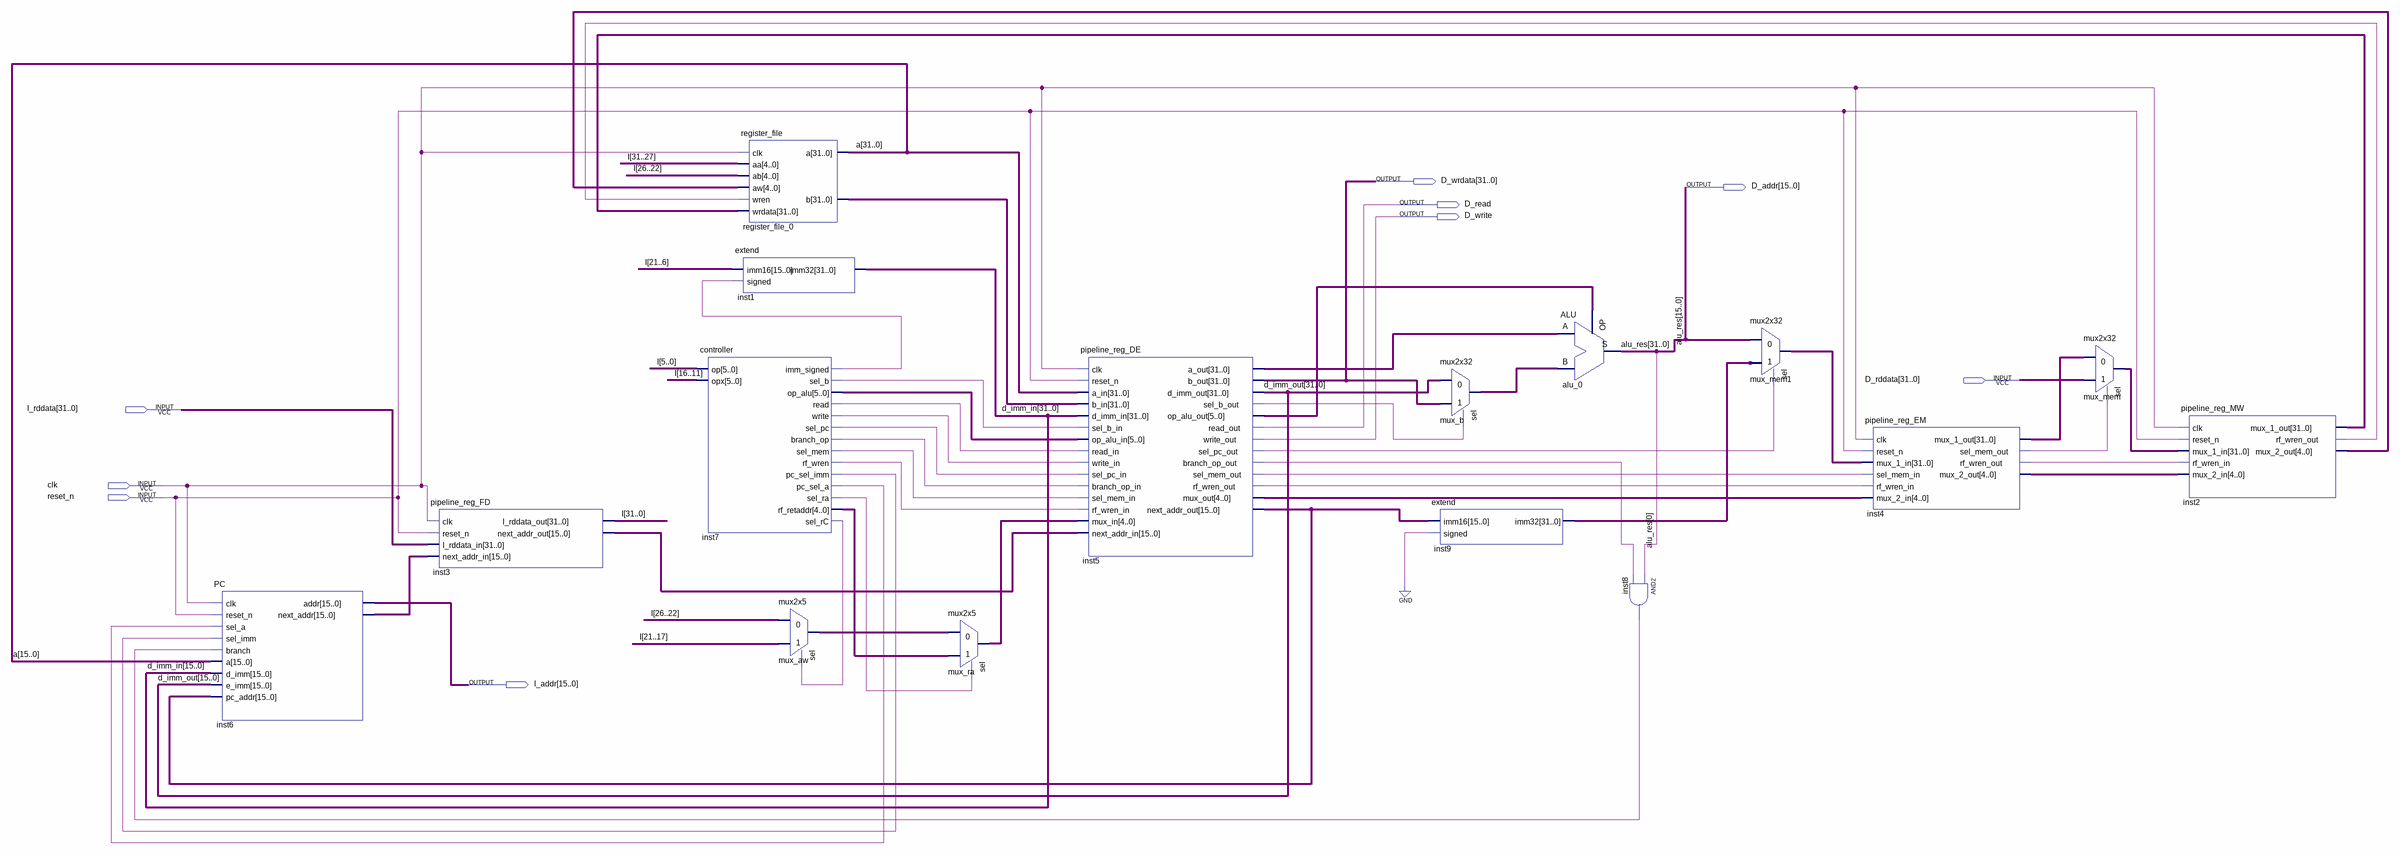
[diagram p0: schematic sheet]
// Quartus schematic CPU.bdf as structural Verilog: 16 symbols, 9 pins
module CPU (
  input  [31:0] D_rddata,
  input  [31:0] I_rddata,
  input  clk,
  input  reset_n,
  output [31:0] D_wrdata,
  output [15:0] D_addr,
  output D_read,
  output D_write,
  output [15:0] I_addr
);

  wire inst2_rf_wren_out, inst4_rf_wren_out, inst4_sel_mem_out, inst5_branch_op_out, inst5_rf_wren_out,
       inst5_sel_b_out, inst5_sel_mem_out, inst5_sel_pc_out, inst7_branch_op, inst7_imm_signed,
       inst7_pc_sel_a, inst7_pc_sel_imm, inst7_read, inst7_rf_wren, inst7_sel_b, inst7_sel_mem, inst7_sel_pc,
       inst7_sel_ra, inst7_sel_rc, inst7_write, inst8_out;
  wire [4:0] inst2_mux_2_out, inst4_mux_2_out, inst5_mux_out, inst7_rf_retaddr, mux_aw_o, mux_ra_o;
  wire [5:0] inst5_op_alu_out, inst7_op_alu;
  wire [15:0] inst3_next_addr_out, inst5_next_addr_out, inst6_next_addr;
  wire [31:0] a, d_imm_in, d_imm_out, I, inst2_mux_1_out, inst4_mux_1_out, inst5_a_out, inst9_imm32, mux_b_o,
       mux_mem1_o, mux_mem_o, register_file_0_b;
  wire [31:16] alu_res;

  PC inst6 (
    .clk(clk), .reset_n(reset_n), .sel_a(inst7_pc_sel_a), .sel_imm(inst7_pc_sel_imm), .branch(inst8_out),
    .a(a[15:0]), .d_imm(d_imm_in[15:0]), .e_imm(d_imm_out[15:0]), .pc_addr(inst5_next_addr_out),
    .addr(I_addr), .next_addr(inst6_next_addr));
  pipeline_reg_FD inst3 (
    .clk(clk), .reset_n(reset_n), .I_rddata_in(I_rddata), .next_addr_in(inst6_next_addr), .I_rddata_out(I),
    .next_addr_out(inst3_next_addr_out));
  register_file register_file_0 (
    .clk(clk), .aa(I[31:27]), .ab(I[26:22]), .aw(inst2_mux_2_out), .wren(inst2_rf_wren_out),
    .wrdata(inst2_mux_1_out), .a(a), .b(register_file_0_b));
  extend inst1 (.imm16(I[21:6]), .\signed (inst7_imm_signed), .imm32(d_imm_in));
  controller inst7 (
    .op(I[5:0]), .opx(I[16:11]), .imm_signed(inst7_imm_signed), .sel_b(inst7_sel_b), .op_alu(inst7_op_alu),
    .read(inst7_read), .write(inst7_write), .sel_pc(inst7_sel_pc), .branch_op(inst7_branch_op),
    .sel_mem(inst7_sel_mem), .rf_wren(inst7_rf_wren), .pc_sel_imm(inst7_pc_sel_imm),
    .pc_sel_a(inst7_pc_sel_a), .sel_ra(inst7_sel_ra), .rf_retaddr(inst7_rf_retaddr), .sel_rC(inst7_sel_rc));
  mux2x5 mux_aw (.i0(I[26:22]), .i1(I[21:17]), .sel(inst7_sel_rc), .o(mux_aw_o));
  mux2x5 mux_ra (.i0(mux_aw_o), .i1(inst7_rf_retaddr), .sel(inst7_sel_ra), .o(mux_ra_o));
  pipeline_reg_DE inst5 (
    .clk(clk), .reset_n(reset_n), .a_in(a), .b_in(register_file_0_b), .d_imm_in(d_imm_in),
    .sel_b_in(inst7_sel_b), .op_alu_in(inst7_op_alu), .read_in(inst7_read), .write_in(inst7_write),
    .sel_pc_in(inst7_sel_pc), .branch_op_in(inst7_branch_op), .sel_mem_in(inst7_sel_mem),
    .rf_wren_in(inst7_rf_wren), .mux_in(mux_ra_o), .next_addr_in(inst3_next_addr_out), .a_out(inst5_a_out),
    .b_out(D_wrdata), .d_imm_out(d_imm_out), .sel_b_out(inst5_sel_b_out), .op_alu_out(inst5_op_alu_out),
    .read_out(D_read), .write_out(D_write), .sel_pc_out(inst5_sel_pc_out),
    .branch_op_out(inst5_branch_op_out), .sel_mem_out(inst5_sel_mem_out), .rf_wren_out(inst5_rf_wren_out),
    .mux_out(inst5_mux_out), .next_addr_out(inst5_next_addr_out));
  mux2x32 mux_b (.i0(d_imm_out), .i1(D_wrdata), .sel(inst5_sel_b_out), .o(mux_b_o));
  extend inst9 (.imm16(inst5_next_addr_out), .\signed (1'b0), .imm32(inst9_imm32));
  ALU alu_0 (.a(inst5_a_out), .b(mux_b_o), .op(inst5_op_alu_out), .s({alu_res, D_addr}));
  and inst8 (inst8_out, D_addr[0], inst5_branch_op_out);
  mux2x32 mux_mem1 (.i0({alu_res, D_addr}), .i1(inst9_imm32), .sel(inst5_sel_pc_out), .o(mux_mem1_o));
  pipeline_reg_EM inst4 (
    .clk(clk), .reset_n(reset_n), .mux_1_in(mux_mem1_o), .sel_mem_in(inst5_sel_mem_out),
    .rf_wren_in(inst5_rf_wren_out), .mux_2_in(inst5_mux_out), .mux_1_out(inst4_mux_1_out),
    .sel_mem_out(inst4_sel_mem_out), .rf_wren_out(inst4_rf_wren_out), .mux_2_out(inst4_mux_2_out));
  mux2x32 mux_mem (.i0(inst4_mux_1_out), .i1(D_rddata), .sel(inst4_sel_mem_out), .o(mux_mem_o));
  pipeline_reg_MW inst2 (
    .clk(clk), .reset_n(reset_n), .mux_1_in(mux_mem_o), .rf_wren_in(inst4_rf_wren_out),
    .mux_2_in(inst4_mux_2_out), .mux_1_out(inst2_mux_1_out), .rf_wren_out(inst2_rf_wren_out),
    .mux_2_out(inst2_mux_2_out));

  // Other names for the same wires on the sheet: alu_res[15:0] = D_addr
endmodule
